# EasyEDA schematic 1-Schematic_R4_Odzyskowa_Dolna.json

## Sheets
1 ESP: TITLE: Sheet_1; REV: 1.0; Date: 2021-07-10; Sheet: 1/1; Drawn By: KowalDrzo; Company: Your Company
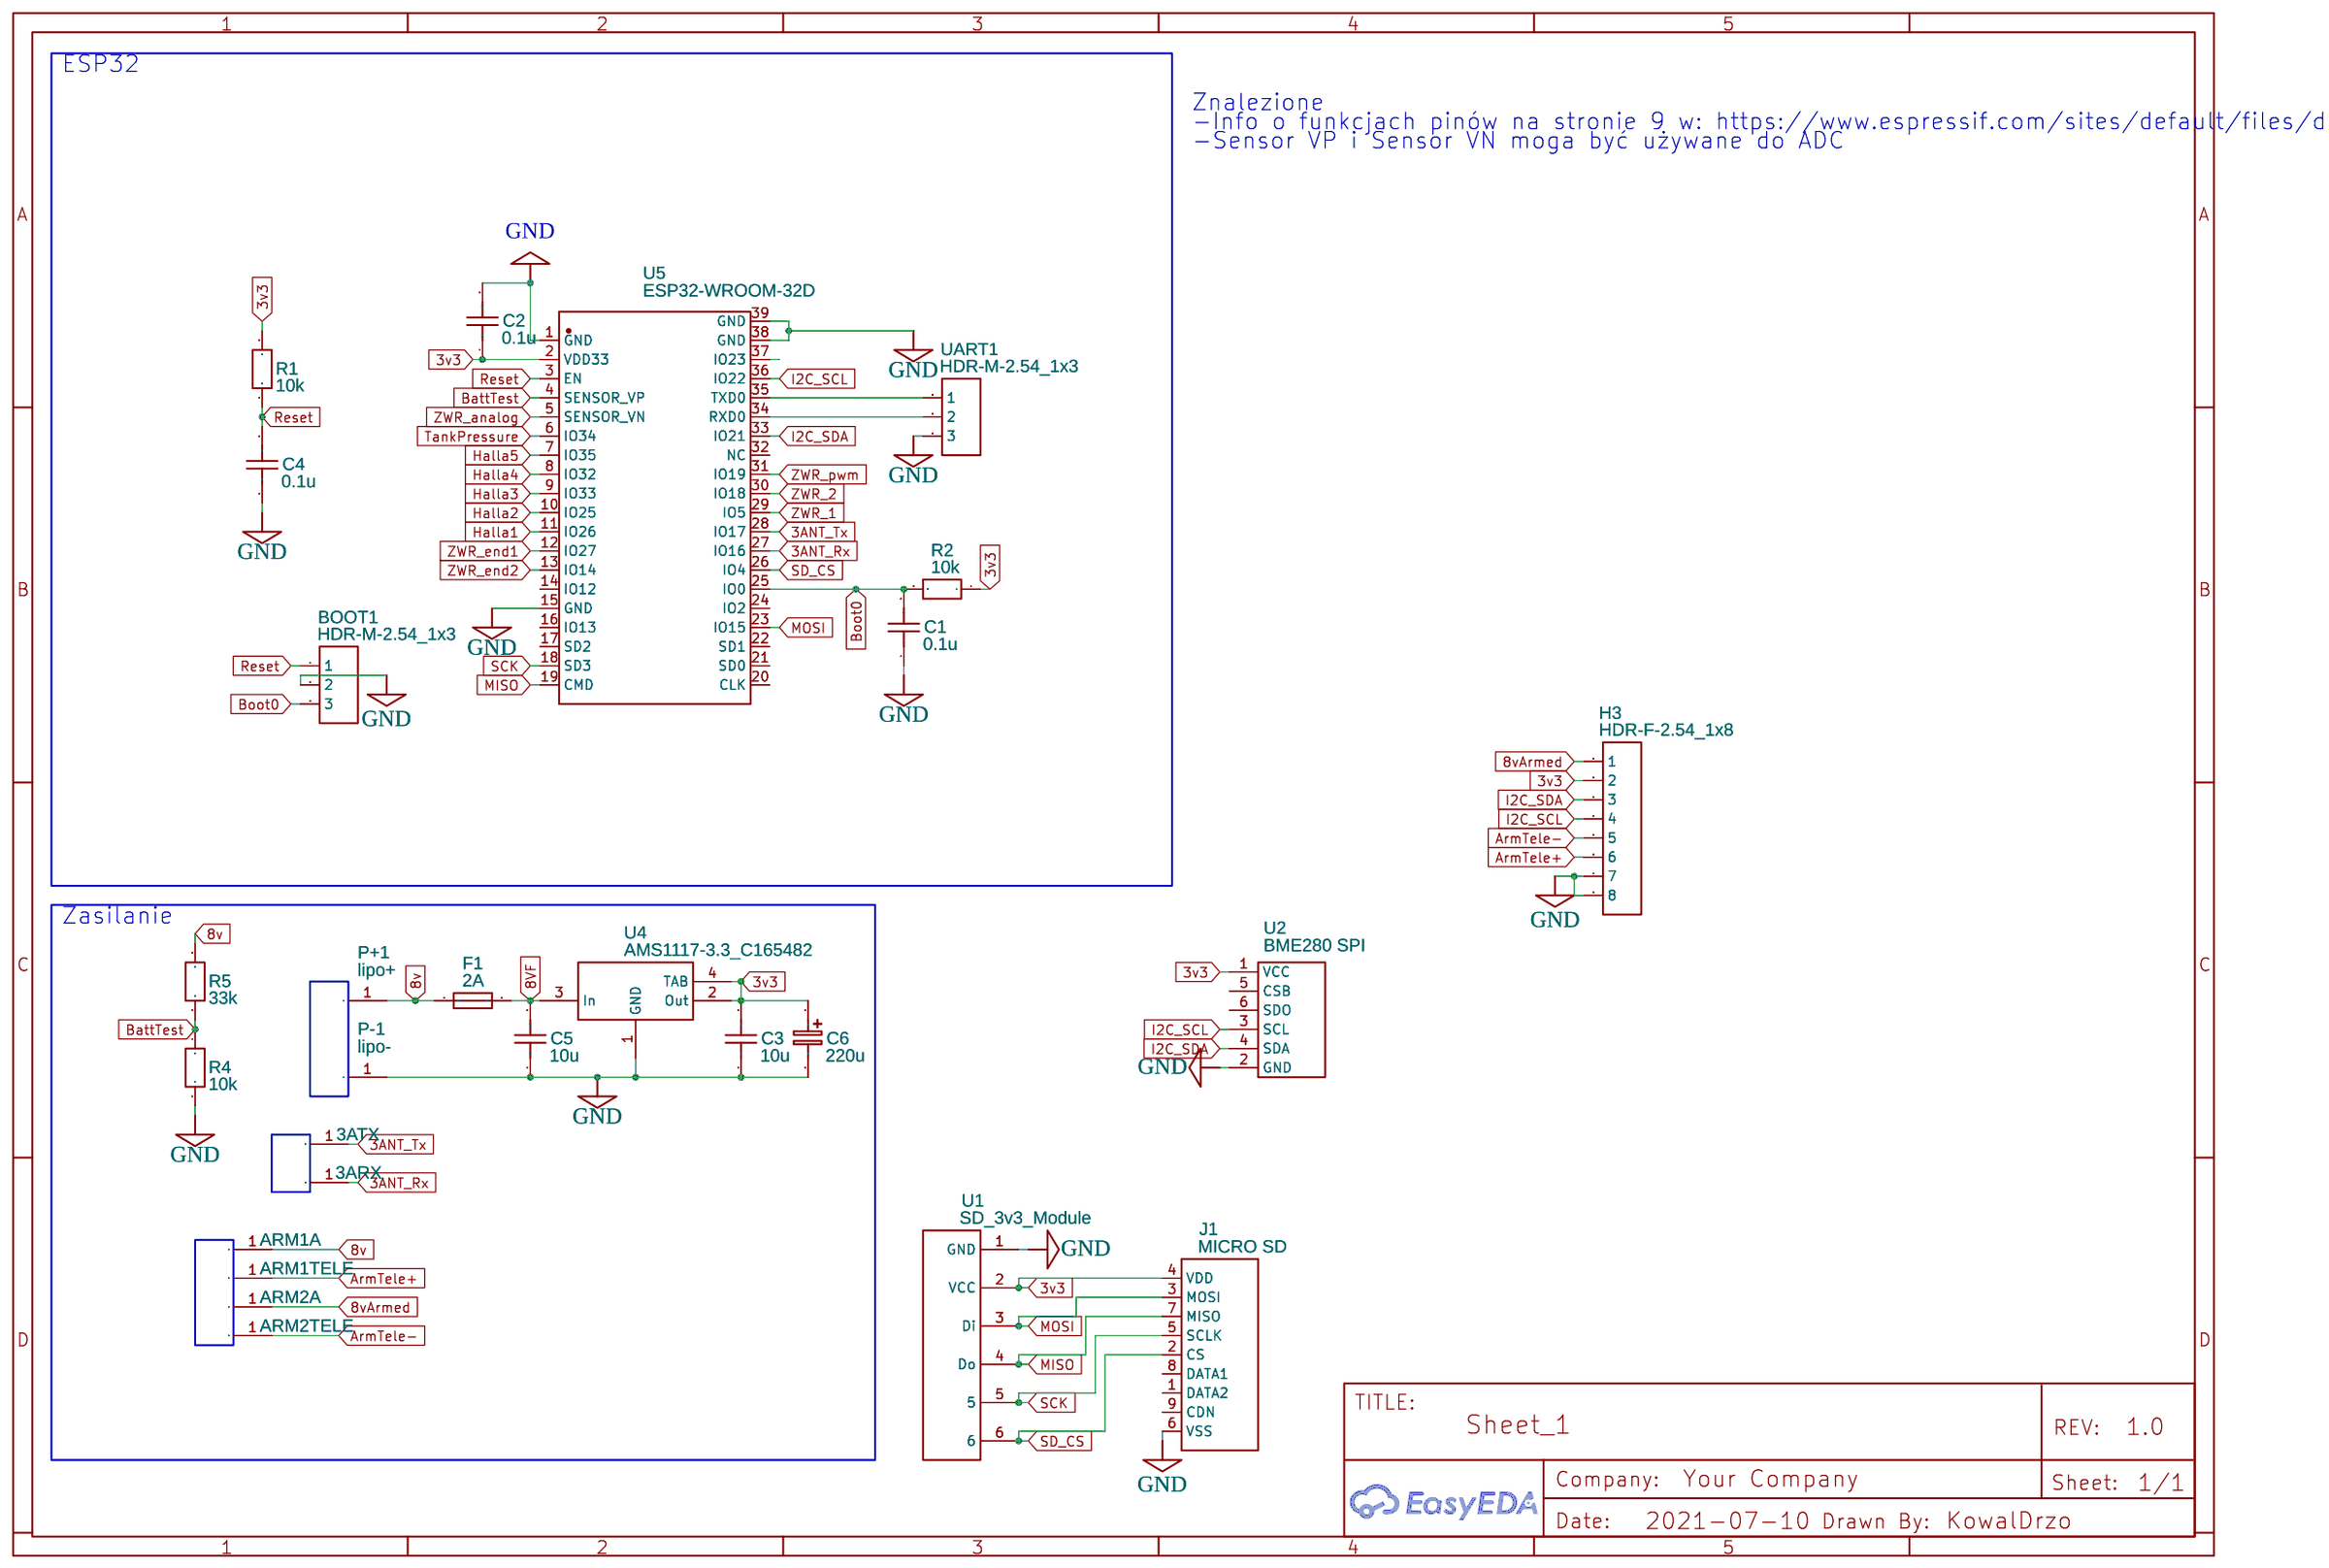
[diagram p0: ESP]
2 Tank_control: TITLE: Upper_Valve; Date: 2021-07-17
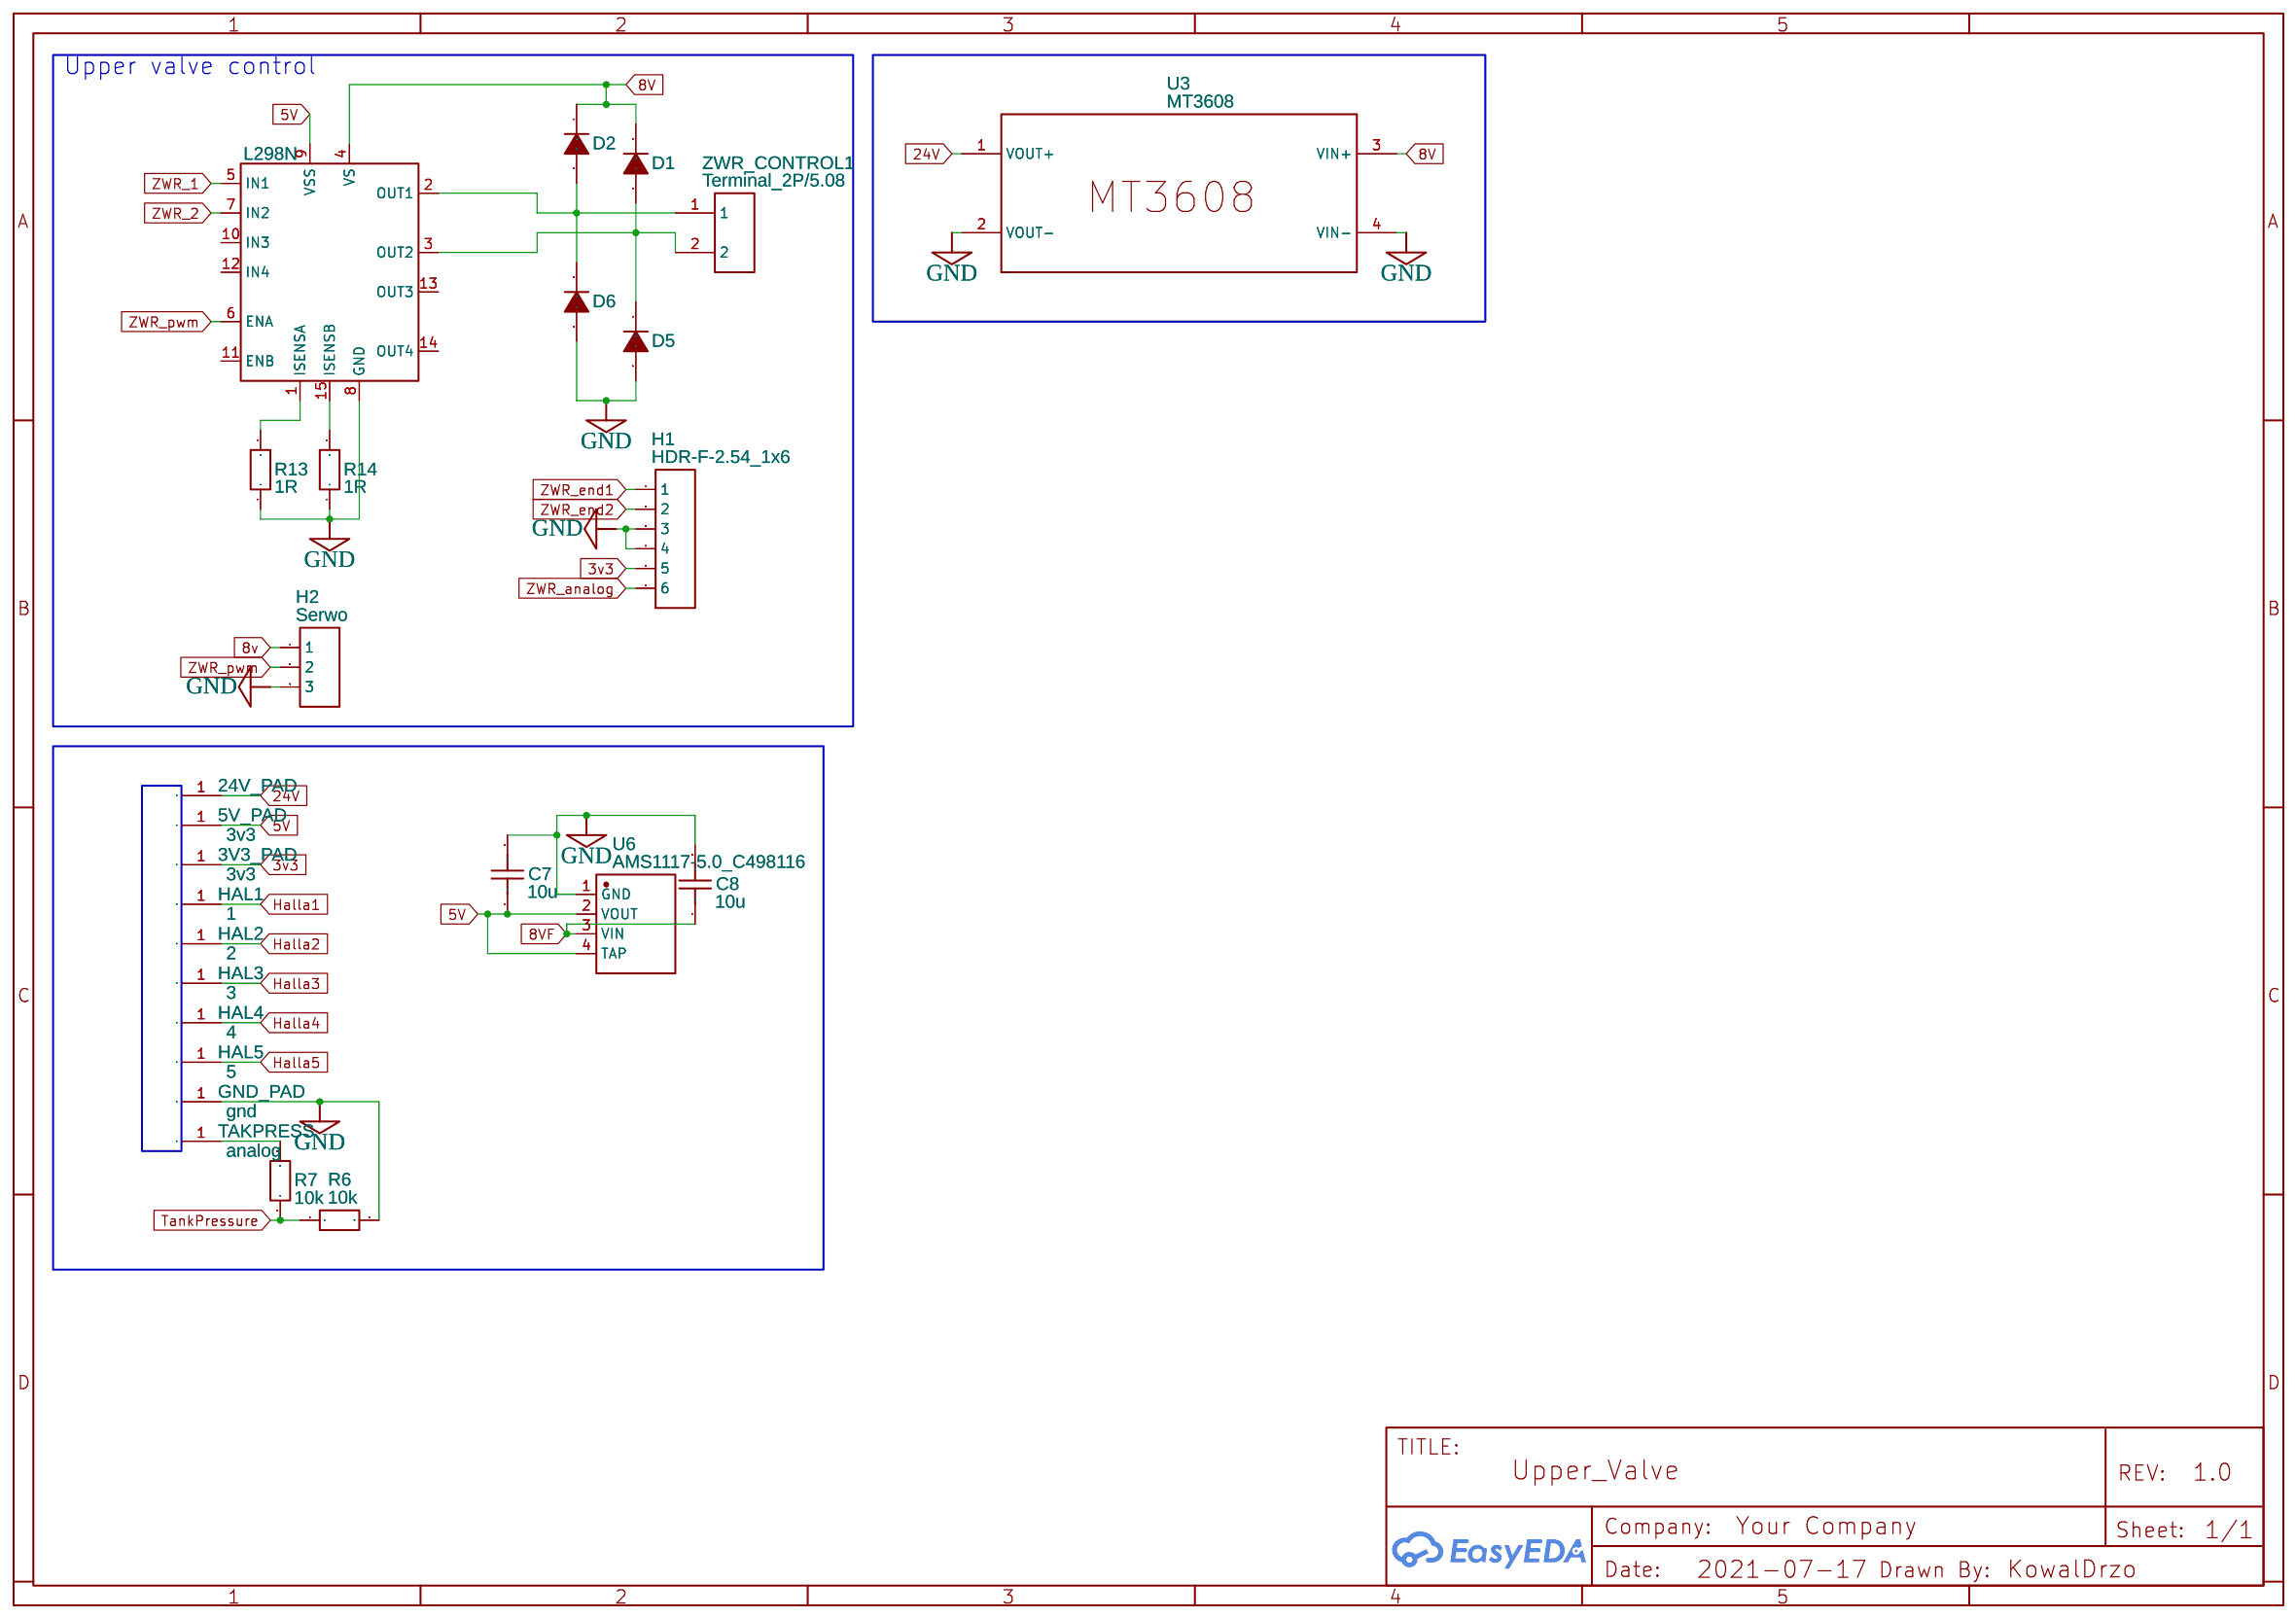
[diagram p1: Tank_control]

## Parts
sheet ESP
3ARX  3v3  [PAD 4MMX4MM]
3ATX  3v3  [PAD 4MMX4MM]
ARM1A  3v3  [PAD 4MMX4MM]
ARM1TELE  3v3  [PAD 4MMX4MM]
ARM2A  3v3  [PAD 4MMX4MM]
ARM2TELE  3v3  [PAD 4MMX4MM]
BOOT1  HDR-M-2.54_1x3  [HDR-M-2.54_1X3]
C1  0.1u  [C0805]
C2  0.1u  [C0805]
C3  10u  [C0805]
C4  0.1u  [C0805]
C5  10u  [C0805]
C6  220u  [CAP-D5.0×F2.0]
F1  2A  [FUSE_1206]
H3  HDR-F-2.54_1x8  [HDR-F-2.54_1X8]
J1  MICRO SD  [MICRO-SD9+4P-SMD-16.1X14.5X1.85MM]
P+1  lipo+  [PAD 4MMX4MM]
P-1  lipo-  [PAD 4MMX4MM]
R1  10k  [R0805]
R2  10k  [R0805]
R4  10k  [R0805]
R5  33k  [R0805]
U1  SD_3v3_Module  [SD_3V3_MODULE]
U2  BME280 SPI  [BME280]
U4  AMS1117-3.3_C165482  [SOT-223_L6.5-W3.5-P2.30-LS7.0-BR]
U5  ESP32-WROOM-32D  [WIFIM-SMD_39P-L25.5-W18.0-P1.27-BL]
UART1  HDR-M-2.54_1x3  [HDR-M-2.54_1X3]
sheet Tank_control
3V3_PAD  3v3  [PAD 4MMX4MM]
5V_PAD  3v3  [PAD 4MMX4MM]
24V_PAD  3v3  [PAD 4MMX4MM]
C7  10u  [C0805]
C8  10u  [C0805]
D1  US2G_C49263  [DO-214AC_L4.3-W2.7-LS5.3-RD]
D2  US2G_C49263  [DO-214AC_L4.3-W2.7-LS5.3-RD]
D5  US2G_C49263  [DO-214AC_L4.3-W2.7-LS5.3-RD]
D6  US2G_C49263  [DO-214AC_L4.3-W2.7-LS5.3-RD]
GND_PAD  gnd  [PAD 4MMX4MM]
H1  HDR-F-2.54_1x6  [HDR-F-2.54_1X6]
H2  Serwo  [HDR-F-2.54_1X3]
HAL1  1  [PAD 4MMX4MM]
HAL2  2  [PAD 4MMX4MM]
HAL3  3  [PAD 4MMX4MM]
HAL4  4  [PAD 4MMX4MM]
HAL5  5  [PAD 4MMX4MM]
MOD3  L298N  [MULTIWATT15V]
R6  10k  [R0805]
R7  10k  [R0805]
R13  1R  [R1206]
R14  1R  [R1206]
TAKPRESS  analog  [PAD 4MMX4MM]
U3  MT3608  [MT3608]
U6  AMS1117-5.0_C498116  [PG-SOT223-4_L6.5-W3.5-P2.30-LS7.0-BR]
ZWR_CONTROL1  Terminal_2P/5.08  [5.08-2P_SCREW_TERMINAL]

## Library data of the parts
3ARX 3ATX 3V3_PAD 5V_PAD 24V_PAD ARM1A ARM1TELE ARM2A ARM2TELE GND_PAD HAL1-HAL5 P+1 P-1 TAKPRESS = pad 4mm: Contributor: butau10
BOOT1 UART1 = HDR-M-2.54_1x3: Supplier Part: C180248; Supplier: LCSC; Contributor: LCEDA_Lib
C1-C5 C7 C8 = C_0805_US: Contributor: LCEDA_Lib
C6 = CE_TH_D5.0×F2.0_EU: Contributor: LCEDA_Lib
F1 = FUSE 1206: Supplier: LCSC; Supplier Part: C187611; Manufacturer: Littelfuse; Manufacturer Part: 0468002.NRHF; Contributor: LCSC
H3 = HDR-F-2.54_1x8: Supplier Part: C225505; Supplier: LCSC; Contributor: LCEDA_Lib
J1 = MICRO SD: Micro SD Card Holder;; Manufacturer Part: ?; Contributor: MCCreeper8890
R1 R2 R4-R7 = R_0805_EU: Contributor: LCEDA_Lib
U1 = SD_3v3_Module: Manufacturer: Polulu; Contributor: KowalDrzo
U2 = BME280 SPI: Manufacturer Part: GY-BME230-3.3 BreakoutNew SchematicLib; Contributor: fmava; Supplier Part: undefined; Supplier: AliExpress
U4 = AMS1117-3.3_C165482: Supplier: LCSC; Supplier Part: C165482; Manufacturer: SK; Manufacturer Part: AMS1117-3.3; Contributor: LCSC; SMT Type: Extend; JLCPCB SMD: Yes; LCSC Assembly: Yes; Paste Type: expand
U5 = ESP32-WROOM-32D: Supplier: LCSC; Supplier Part: C473012; Manufacturer: ESPRESSIF 乐鑫; Contributor: LCSC; Paste Type: expand
D1 D2 D5 D6 = US2G_C49263: Supplier: LCSC; Manufacturer: MDD; Manufacturer Part: US2G; image: //image.lceda.cn/szlcsc/C49263.jpg; Supplier Part: C49263; SMT Type: Extend; JLCPCB SMD: Yes; LCSC Assembly: Yes
H1 = HDR-F-2.54_1x6: Supplier Part: C40877; Supplier: LCSC; Contributor: LCEDA_Lib
H2 = HDR-F-2.54_1x3: Supplier Part: C146690; Supplier: LCSC; Contributor: LCEDA_Lib
MOD3 = L298N: sourceId: HXUgCYWig; Supplier: LCSC; Manufacturer: STMicroelectronics; image: //image.lceda.cn/szlcsc/C19922.jpg; Contributor: thronborg; Supplier Part: C19922
R13 R14 = R_1206_EU: Contributor: LCEDA_Lib
U3 = MT3608: Manufacturer Part: New SchematicLib; Contributor: belmas
U6 = AMS1117-5.0_C498116: Supplier: LCSC; Supplier Part: C498116; Manufacturer: HGC(Huaguan Semicon); Manufacturer Part: AMS1117-5.0; Contributor: LCSC; JLCPCB Part Class: Extended Part
ZWR_CONTROL1 = Terminal_2P/5.08: Manufacturer Part: Screw terminal 2p; Contributor: georges_circuits

## Nets
3v3: 3V3_PAD.1 C2.1 C3.2 C6.1 H1.5 H3.2 J1.4(VDD) R1.2 R2.1 U1.2(VCC) U2.1(VCC) U4.2(Out) U4.4(TAB) U5.2(VDD33)
5V: 5V_PAD.1 C7.1 MOD3.9(VSS) U6.2(VOUT) U6.4(TAP)
8v: ARM1A.1 F1.1 H2.1 P+1.1 R5.2
8V: D1.1(K) D2.1(K) MOD3.4(VS) U3.3(VIN+)
8vArmed: ARM2A.1 H3.1
8VF: C5.2 C8.1 F1.2 U4.3(In) U6.3(VIN)
24V: 24V_PAD.1 U3.1(VOUT+)
GND: BOOT1.2 C1.1 C2.2 C3.1 C4.1 C5.1 C6.2 C7.2 C8.2 D5.2(A) D6.2(A) GND_PAD.1 H1.3 H1.4 H2.3 H3.7 H3.8 J1.6(VSS) MOD3.8(GND) P-1.1 R4.2 R6.2 R13.1 R14.1 U1.1(GND) U2.2(GND) U3.2(VOUT-) U3.4(VIN-) U4.1(GND) U5.1(GND) U5.15(GND) U5.38(GND) U5.39(GND) U6.1(GND) UART1.3
3ANT_Rx: 3ARX.1 U5.27(IO16)
3ANT_Tx: 3ATX.1 U5.28(IO17)
ArmTele+: ARM1TELE.1 H3.6
ArmTele-: ARM2TELE.1 H3.5
BattTest: R4.1 R5.1 U5.4(SENSOR_VP)
Boot0: BOOT1.3 C1.2 R2.2 U5.25(IO0)
Halla1: HAL1.1 U5.11(IO26)
Halla2: HAL2.1 U5.10(IO25)
Halla3: HAL3.1 U5.9(IO33)
Halla4: HAL4.1 U5.8(IO32)
Halla5: HAL5.1 U5.7(IO35)
I2C_SCL: H3.4 U2.3(SCL) U5.36(IO22)
I2C_SDA: H3.3 U2.4(SDA) U5.33(IO21)
MISO: J1.7(MISO) U1.4(Do) U5.19(CMD)
MOSI: J1.3(MOSI) U1.3(Di) U5.23(IO15)
Reset: BOOT1.1 C4.2 R1.1 U5.3(EN)
SCK: J1.5(SCLK) U1.5 U5.18(SD3)
SD_CS: J1.2(CS) U1.6 U5.26(IO4)
TankPressure: R6.1 R7.1 U5.6(IO34)
ZWR_1: MOD3.5(IN1) U5.29(IO5)
ZWR_2: MOD3.7(IN2) U5.30(IO18)
ZWR_analog: H1.6 U5.5(SENSOR_VN)
ZWR_end1: H1.1 U5.12(IO27)
ZWR_end2: H1.2 U5.13(IO14)
ZWR_pwm: H2.2 MOD3.6(ENA) U5.31(IO19)
Net-(D1-2): D1.2(A) D5.1(K) MOD3.3(OUT2) ZWR_CONTROL1.2
Net-(D2-2): D2.2(A) D6.1(K) MOD3.2(OUT1) ZWR_CONTROL1.1
Net-(MOD3-1): MOD3.1(ISENSA) R13.2
Net-(MOD3-15): MOD3.15(ISENSB) R14.2
Net-(R7-2): R7.2 TAKPRESS.1
Net-(U5-34): U5.34(RXD0) UART1.2
Net-(U5-35): U5.35(TXD0) UART1.1

Not connected (* = marked no-connect by the designer): J1 1(DATA2) 8(DATA1) 9(CDN); MOD3 10(IN3) 11(ENB) 12(IN4) 13(OUT3) 14(OUT4); U2 5(CSB) 6(SDO); U5 14(IO12) 16(IO13) 17(SD2) 20(CLK) 21(SD0) 22(SD1) 24(IO2) 32(NC) 37(IO23)

## Notes on the sheets
sheet 1
- ESP32
- -Info o funkcjach pinów na stronie 9 w: https://www.espressif.com/sites/default/files/documentation/esp32-wroom-32d_esp32-wroom-32u_datasheet_en.pdf
- Znalezione
- -Sensor VP i Sensor VN moga być używane do ADC
- Zasilanie
sheet 2
- Upper valve control
